# Altium schematic sheet PATHOS_SOM_CAN.SchDoc
size A4; CompanyName: NTB; Organization: NTB Interstate University of Applied; Address1: Werdenbergstrasse 4; Address3: 9471 Buchs; Address4: Switzerland; Organization1: Sciences of Technology Buchs; Size: A4
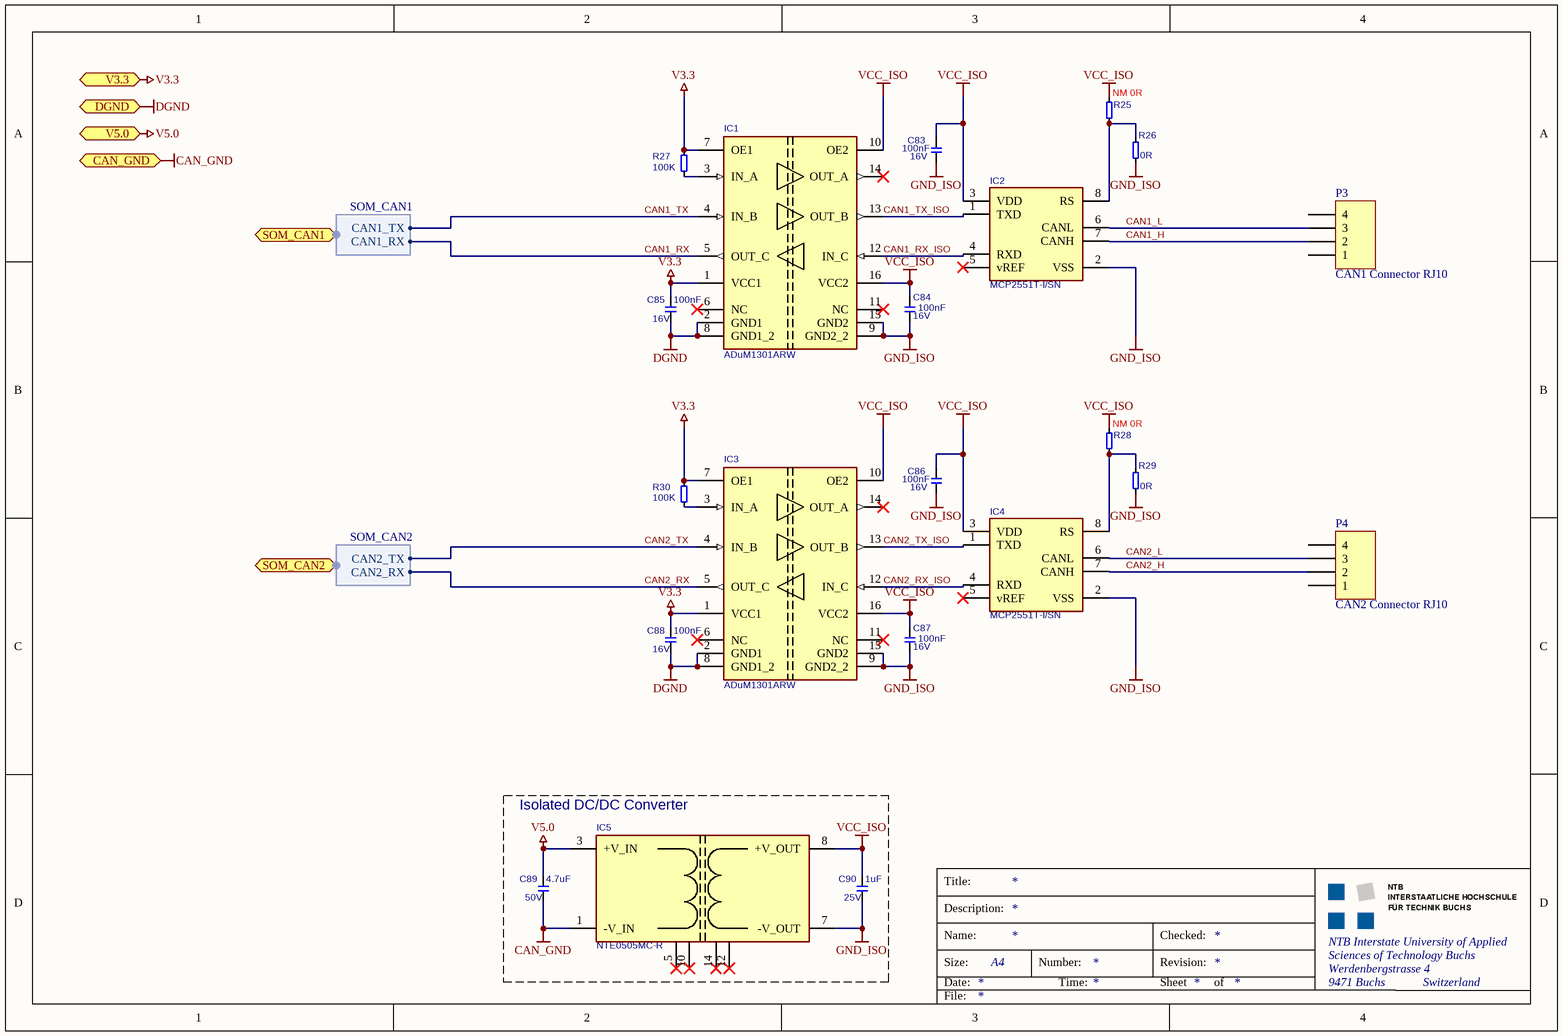
[diagram p0: PATHOS_SOM_CAN.SchDoc]

## Parts
C83  Rating: 16V  [0603_3D]  (hidden comment: 100nF)
C84  Rating: 16V  [0603_3D]  (hidden comment: 100nF)
C85  Rating: 16V  [0603_3D]  (hidden comment: 100nF)
C86  Rating: 16V  [0603_3D]  (hidden comment: 100nF)
C87  Rating: 16V  [0603_3D]  (hidden comment: 100nF)
C88  Rating: 16V  [0603_3D]  (hidden comment: 100nF)
C89  Rating: 50V  [1206]  (hidden comment: 4.7uF)
C90  Rating: 25V  [0603_3D]  (hidden comment: 1uF)
IC1  ADuM1301ARW  [T_AD_ADuM1300ARW]
IC2  MCP2551T-I/SN  [SOIC127P600X173-8N]
IC3  ADuM1301ARW  [T_AD_ADuM1300ARW]
IC4  MCP2551T-I/SN  [SOIC127P600X173-8N]
IC5  NTE0505MC-R  [T_MURATA_NTE0505MC-R]
P3  CAN1 Connector RJ10  [95009-2447]
P4  CAN2 Connector RJ10  [95009-2447]
R25  NM 0R  [0603_3D]
R26  0R  [0603_3D]
R27  100K  [0603_3D]
R28  NM 0R  [0603_3D]
R29  0R  [0603_3D]
R30  100K  [0603_3D]

## Blocks framed on the sheet
Isolated DC/DC Converter: C89 C90 IC5

## Ports
CAN_GND, DGND, SOM_CAN1 (harness SOM_CAN1), SOM_CAN2 (harness SOM_CAN2), V3.3, V5.0

## Harnesses
SOM_CAN1: CAN1_TX, CAN1_RX
SOM_CAN2: CAN2_TX, CAN2_RX

## Nets
CAN_GND: C89.1 IC5.1(-V_IN) ; port CAN_GND
DGND: C85.1 C88.1 IC1.2(GND1) IC1.8(GND1_2) IC3.2(GND1) IC3.8(GND1_2) ; port DGND
GND_ISO: C83.1 C84.1 C86.1 C87.1 C90.1 IC1.9(GND2_2) IC1.15(GND2) IC2.2(VSS) IC3.9(GND2_2) IC3.15(GND2) IC4.2(VSS) IC5.7(-V_OUT) R26.1 R29.1
V3.3: C85.2 C88.2 IC1.1(VCC1) IC1.7(OE1) IC3.1(VCC1) IC3.7(OE1) R27.2 R30.2 ; port V3.3
V5.0: C89.2 IC5.3(+V_IN) ; port V5.0
VCC_ISO: C83.2 C84.2 C86.2 C87.2 C90.2 IC1.10(OE2) IC1.16(VCC2) IC2.3(VDD) IC3.10(OE2) IC3.16(VCC2) IC4.3(VDD) IC5.8(+V_OUT) R25.2 R28.2
CAN1_H: IC2.7(CANH) P3.2
CAN1_L: IC2.6(CANL) P3.3
CAN1_RX: IC1.5(OUT_C) ; port SOM_CAN1.CAN1_RX
CAN1_RX_ISO: IC1.12(IN_C) IC2.4(RXD)
CAN1_TX: IC1.4(IN_B) ; port SOM_CAN1.CAN1_TX
CAN1_TX_ISO: IC1.13(OUT_B) IC2.1(TXD)
CAN2_H: IC4.7(CANH) P4.2
CAN2_L: IC4.6(CANL) P4.3
CAN2_RX: IC3.5(OUT_C) ; port SOM_CAN2.CAN2_RX
CAN2_RX_ISO: IC3.12(IN_C) IC4.4(RXD)
CAN2_TX: IC3.4(IN_B) ; port SOM_CAN2.CAN2_TX
CAN2_TX_ISO: IC3.13(OUT_B) IC4.1(TXD)
NetIC1_3: IC1.3(IN_A) R27.1
NetIC2_8: IC2.8(RS) R25.1 R26.2
NetIC3_3: IC3.3(IN_A) R30.1
NetIC4_8: IC4.8(RS) R28.1 R29.2

Not connected (* = marked no-connect by the designer): IC1 6(NC)* 11(NC)* 14(OUT_A)*; IC2 5(vREF)*; IC3 6(NC)* 11(NC)* 14(OUT_A)*; IC4 5(vREF)*; IC5 5(NC)* 10(NC)* 12(NC)* 14(NC)*; P3 1 4; P4 1 4

## Notes on the sheet
- Title:
- Description:
- Size:
- Date:
- Name:
- Number:
- Time:
- Revision:
- Sheet
- Checked:
- of
- File:

## Library data of the parts
C83-C90 = C-X7R-100nF-16V-10%-0603: Capacitor Ceramic X7R 100nF 16V 10% 0603; Tolerance: 10%; Type: X7R
  C83-C88: Value: 100nF
  C89: Value: 4.7uF
  C90: Value: 1uF
IC1 IC3 = IC-AD-ADuM1301ARW: Digital Isolator; Manufacturer Name: Analog Devices; Manufacturer Part No.: ADuM1301ARW
IC2 IC4 = IC-MC-MCP2551T-I/SN: High speed CAN Transceiver; Manufacturer Name: Microchip; Manufacturer Part No.: MCP2551T-I/SN
IC5 = IC-MUR-NTE0505MC-R: Isolated DC/DC Converter; Manufacturer Name: Murata; Manufacturer Part No.: NTE0505MC-R
P3 P4 = Header 4: Header, 4-Pin; LatestRevisionDate: 17-Jul-2002; LatestRevisionNote: Re-released for DXP Platform.; Publisher: Altium Limited
R25 R26 R28 R29 = R-0R-63mW-1%-0603: Resistor 0 ohm 63mW 1% 0603; Rating: 63mW; Tolerance: 1%; Value: 0R
R27 R30 = R-100KR-63mW-5%-0603: Resistor 100 Kohm 63mW 5% 0603; Value: 100KR; Rating: 63mW; Tolerance: 5%